# EAGLE schematic BTW_Robot (EAGLE 9.6.2)
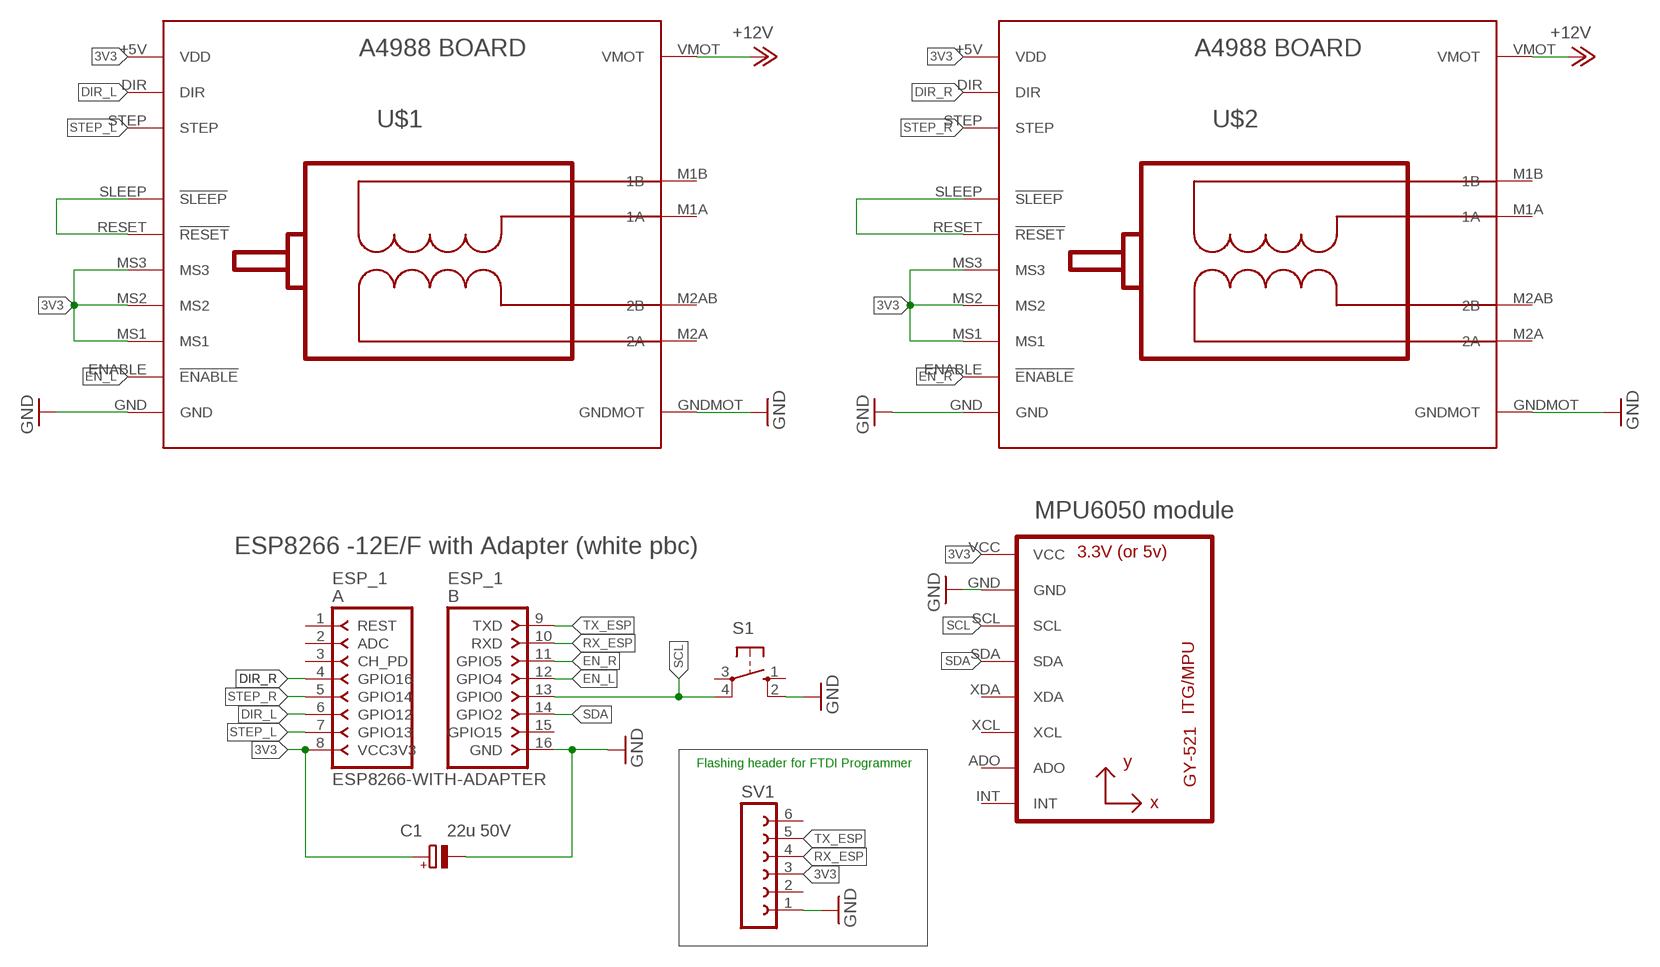
[diagram p0: schematic, sheet 1]

## Parts
C1  22u 50V  CPOL-EUE2-4  [E2-4]
ESP_1  ESP8266-WITH-ADAPTER  [ESP8266-ADAPTER]
S1  10-XX  [B3F-10XX]
SV1  FE06W  [FE06W]
U1  GY-521MPU6050  [GY-521]
U$1  BOARD_A4988  [BOARD_A4988]
U$2  BOARD_A4988  [BOARD_A4988]

## Nets
3V3: C1.+ ESP_1.8(VCC3V3)
+12V: U$1.VMOT U$2.VMOT
DIR_L: ESP_1.6(GPIO12)
DIR_R: ESP_1.4(GPIO16)
EN_L: ESP_1.12(GPIO4)
EN_R: ESP_1.11(GPIO5)
GND: C1.- ESP_1.16(GND) S1.2(S1) SV1.1 U1.GND U$1.GND U$1.GNDMOT U$2.GND U$2.GNDMOT
N$1: U$1.MS1 U$1.MS2 U$1.MS3
N$2: U$2.MS1 U$2.MS2 U$2.MS3
N$3: U$1.RESET(!RESET) U$1.SLEEP(!SLEEP)
N$4: U$2.RESET(!RESET) U$2.SLEEP(!SLEEP)
RX_ESP: ESP_1.10(RXD)
SCL: ESP_1.13(GPIO0) S1.4(P1)
SDA: ESP_1.14(GPIO2)
STEP_L: ESP_1.7(GPIO13)
STEP_R: ESP_1.5(GPIO14)
TX_ESP: ESP_1.9(TXD)
Unconnected: ESP_1.1(REST) ESP_1.2(ADC) ESP_1.3(CH_PD) ESP_1.15(GPIO15) S1.1(S) S1.3(P) SV1.2 SV1.3 SV1.4 SV1.5 SV1.6 U1.ADO U1.INT U1.SCL U1.SDA U1.VCC U1.XCL U1.XDA U$1.DIR U$1.ENABLE(!ENABLE) U$1.M1A(1A) U$1.M1B(1B) U$1.M2A(2A) U$1.M2AB(2B) U$1.STEP U$2.DIR U$2.ENABLE(!ENABLE) U$2.M1A(1A) U$2.M1B(1B) U$2.M2A(2A) U$2.M2AB(2B) U$2.STEP

## Notes on the sheet
- MPU6050 module
- ESP8266 -12E/F with Adapter (white pbc)
- Flashing header for FTDI Programmer

## Power pins joined to a net without a drawn wire
VDD: U$1.+5V(VDD) U$2.+5V(VDD)

## Library data of the parts
C1 = rcl:CPOL-EU: POLARIZED CAPACITOR, European symbol; SPICEPREFIX: C
ESP_1 = esp8266_with_adapter:ESP8266-WITH-ADAPTER: ESP8266 Adapter for ESP8266-03, ESP8266-04, ESP8266-07, ESP8266-08, ESP8266-12 and similar. (c) by Bartosz Batorek obi--wan@wp.pl
S1 = switch-omron:10-XX: OMRON SWITCH; MPN: B3F-1000; OC_FARNELL: 176432; OC_NEWARK: 36M3542
SV1 = con-lsta:FE06W: FEMALE HEADER; OC_FARNELL: unknown; OC_NEWARK: unknown
U1 = gy-521:GY-521
U$1 U$2 = Clean-Kong:BOARD_A4988